# Altium project SIO2MKR.PrjPcb (part 1 of 2)
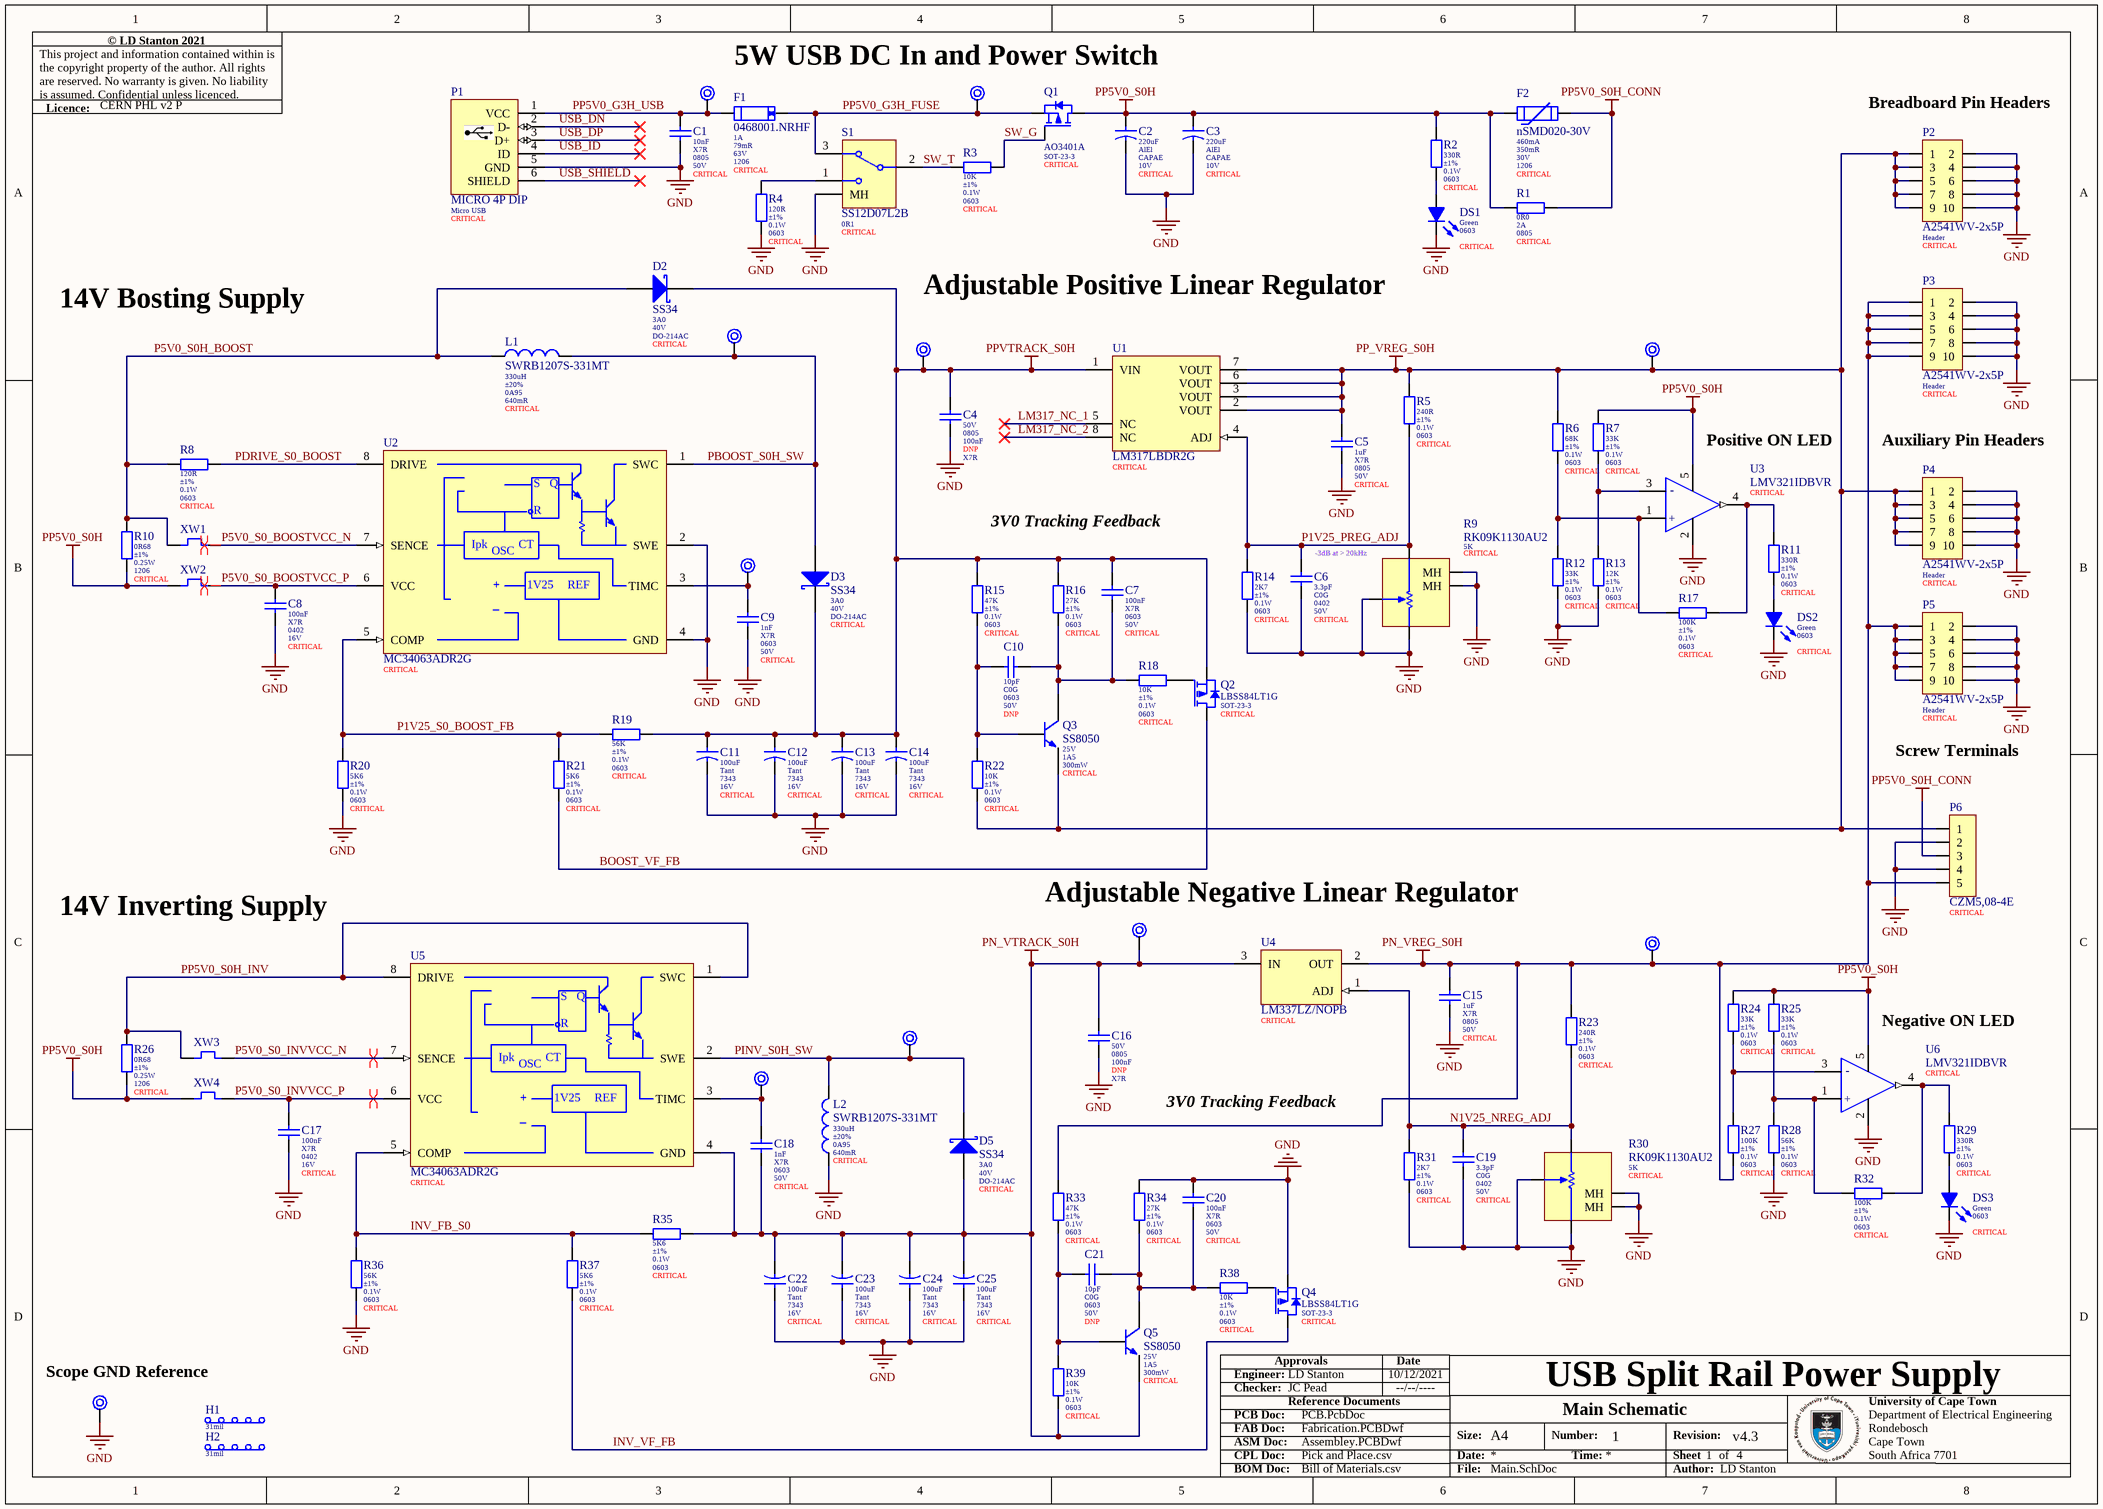
[diagram p0: Main.SchDoc]
SCH_DOC: Main.SchDoc; Rev_No_4: v4.3; Rev_No_3: v3.0; Rev_No_2: v2.0; Rev_No_1: v1.0; Rev_Desc_4: Final Design; Rev_Desc_3: Design Candidate; Rev_Desc_2: Second Prototype; Rev_Desc_1: Initial Prototype; Rev_Date_4: 10/12/2021; Rev_Date_3: 05/08/2021; Rev_Date_2: 07/06/2021; Rev_Date_1: 09/04/2021; Project_Revision: v4.3; Licence: CERN PHL v2 P; DwgTitleLine2: USB Split Rail Power Supply for Breadboards; DwgTitleLine1: SIO2MKR; CPL_DOC: Pick and Place.csv; Checker: JC Pead; BOM_DOC: Bill of Materials.csv; Approv_Date_Eng: 10/12/2021; Approv_Date_Chk: --/--/----
5 sheets, 212 parts. Net scope: global (net labels, ports and power ports of the same name join across sheets).
Board files: PCB.PcbDoc, Panel.PcbDoc
Sheets:
  Main.SchDoc
  Functional Diagram.SchDoc
  Illustrations 1.SchDoc
  Illustrations 2.SchDoc
  Illustrations 3.SchDoc

## Sheet Main.SchDoc: Main Schematic
size A3; SPICEModelCacheWFTKRAJF: <root> / <DocumentId>WFTKRAJF</DocumentId> / <CacheFrame Number="0"> / <Model Name="mc34063" Kind="ckt"> / <Text>.SUBCKT mc34063 csw esw ct comm fb vcc ipk cdr / * csw = switch BJT collector, esw = switch BJT emitter ct = timing capacitor, comm = common / * fb = feedback control, vcc = power in, ipk = peak limiting, cdr = driver BJT collector / * pin numbers match order of inputs above. / * Voltage Sources / Vlogic vp5v comm DC 5V / * Reference and feedback comparator / * The reference is at 1.25V but decreases linearly to zero for Vcc &lt; 3.75V / Breference ref comm V=(V(vcc,comm)-1.25)*u(V(vcc,comm)-1.25)-(V(vcc,comm)-2.5)*u(V(vcc,comm)-3.75) / B1 1 comm V=u(V(ref,fb)) / R6 1 cinvcontrol 10K / C6 cinvcontrol comm 10pF / * Oscillator / * Hysteresis switch to drive current into timing capacitor / R1 vp5v osc 10k / S1 osc comm ct comm swmod / .MODEL swmod SW (SW VT = 1 VH = 0.25) / * Current source to drive charge/discharge currents for the timing capacitor / Bcurrent ct comm I=-35uA+255uA*u(2.5-V(osc,comm)) / * Current limiting circuit increases the charge rate of the timing capacitor / Qlimit ct ipk vcc limitQ / .model limitQ PNP(IS=1E-12 VAF=100 BF=200 IKF=0.1 XTB=1.5 BR=4 / +  CJC=4.5E-12 CJE=10E-12 RB=20 RC=0.1 RE=0.1 TR=250E-9 TF=350E-12 ITF=1 VTF=2 XTF=3) / * Differentiator to provide delays to overcome latch race conditions / Ctrigger osc delay  1pF / Rtrigger delay comm 100K / * Delay pulse squaring comparators plus Delay gating logic. / * inverse of positive delay transition anded with the oscillator to delay the start of / * the next high part. This is then nanded with the feedback gating signal. / Bsetgate set comm V=(1-(1-u(V(delay,comm)-1))*u(V(osc,comm)-2.5)*u(V(cinvcontrol,comm)-0.5)) / * Reset is just the negative delay transition anded with the oscillator and inverted. / Bminus reset comm V=(1-u(V(delay,comm)+1)*(1-u(V(osc,comm)-2.5))) / * SR Latch / Blatch1 4 comm V=(1-V(reset,comm)*u(V(3,comm)-0.5)) / R4 4 2 10K / C4 2 comm 1pF IC=1V / Blatch2 gate comm V=(1-V(set,comm)*u(V(2,comm)-0.5)) / R5 gate 3 10K / C5 3 comm 1pF / * Output switch gating and drive / Bcurrentdrive currentdrive comm I=10mA-20mA*V(gate,comm)*u(V(cinvcontrol,comm)-0.5) / Qdrive cdr currentdrive swbase driverQ / .model driverQ NPN(Bf=300 CJC=4pF CJE=8pF RB=20 RC=0.1 RE=0.1) / D2 comm currentdrive 1N914 / D1 currentdrive vcc 1N914 / .MODEL 1N914 D(Is=2.52n Rs=0.568 N=1.752 Cjo=4p M=.4 Tt=20n) / Rde swbase esw 100 / Qswitch csw swbase esw switchQ / .MODEL switchQ npn (BF=75 RB=10 RE=0.25 RC=0.25 CJE=10pF CJC=10pF) / .ends</Text> / </Model> / </CacheFrame> / </root>; ApprovedBy: LD Stanton; CheckedBy: None; Author: LD Stanton; CompanyName: University of Cape Town; DrawnBy: Lawrence Stanton; Engineer: LD Stanton; Organization: University of Cape Town; Address1: Department of Electrical Engineering; Address2: Rondebosch; Address3: Cape Town; Address4: South Africa 7701; DocumentNumber: 1; Revision: v2.2; SheetNumber: 1; SheetTotal: 4; PCB_Doc: PCB.PcbDoc; ASM_Doc: Assembley.PCBDwf; FAB_Doc: Fabrication.PCBDwf; CML_Doc: Pick and Place.csv; BOM_Doc: Bill of Materials.csv; Project_Name: USB Split Rail Power Supply

### Parts
(Parts that share a designator on the sheet are numbered #1, #2 ... from top to bottom, then left to right.)
C1#1  value 10nF  Dielectric: X7R  Package: 0805  Voltage: 50V  Populate: CRITICAL  [0605_065_A_N]  (hidden comment: CL21B103KBANNNC)
C2#1  value 220uF  Dielectric: AlEl  Package: CAPAE  Voltage: 10V  Populate: CRITICAL  [CAPAE 6354]  (hidden comment: RVT1A221M0605)
C3  value 220uF  Dielectric: AlEl  Package: CAPAE  Voltage: 10V  Populate: CRITICAL  [CAPAE 6354]  (hidden comment: RVT1A221M0605)
C4  value 100nF  Voltage: 50V  Populate: DNP  Dielectric: X7R  [0805]  (hidden comment: CC0805KRX7R9BB104)
C5  value 1uF  Dielectric: X7R  Package: 0805  Voltage: 50V  Populate: CRITICAL  [0805_125_F_N]  (hidden comment: CL21B105KBFNNNE)
C6  value 3.3pF  Dielectric: C0G  Package: 0402  Voltage: 50V  Populate: CRITICAL  [0402_050]  (hidden comment: 0402CG3R3C500NT)
C7  value 100nF  Dielectric: X7R  Voltage: 50V  Populate: CRITICAL  [0603]  (hidden comment: CC0603KRX7R9BB104)
C8  value 100nF  Dielectric: X7R  Package: 0402  Voltage: 16V  Populate: CRITICAL  [0402_050_5_N]  (hidden comment: CL05B104KO5NNNC)
C9  value 1nF  Dielectric: X7R  Package: 0603  Voltage: 50V  Populate: CRITICAL  [0603_080_8_N]  (hidden comment: CL10B102KB8NNNC)
C10  value 10pF  Dielectric: C0G  Package: 0603  Voltage: 50V  Populate: DNP  [0603_080_8_N]  (hidden comment: MLCC 10pF 0603 50V C0G)
C11  value 100uF  Dielectric: Tant  Package: 7343  Voltage: 16V  Populate: CRITICAL  [Case D]  (hidden comment: 293D107X9016D2TE3)
C12  value 100uF  Dielectric: Tant  Package: 7343  Voltage: 16V  Populate: CRITICAL  [Case D]  (hidden comment: 293D107X9016D2TE3)
C13  value 100uF  Dielectric: Tant  Package: 7343  Voltage: 16V  Populate: CRITICAL  [Case D]  (hidden comment: 293D107X9016D2TE3)
C14  value 100uF  Dielectric: Tant  Package: 7343  Voltage: 16V  Populate: CRITICAL  [Case D]  (hidden comment: 293D107X9016D2TE3)
C15  value 1uF  Dielectric: X7R  Package: 0805  Voltage: 50V  Populate: CRITICAL  [0805_125_F_N]  (hidden comment: CL21B105KBFNNNE)
C16  value 100nF  Voltage: 50V  Populate: DNP  Dielectric: X7R  [0805]  (hidden comment: CC0805KRX7R9BB104)
C17  value 100nF  Dielectric: X7R  Package: 0402  Voltage: 16V  Populate: CRITICAL  [0402_050_5_N]  (hidden comment: CL05B104KO5NNNC)
C18  value 1nF  Dielectric: X7R  Package: 0603  Voltage: 50V  Populate: CRITICAL  [0603_080_8_N]  (hidden comment: CL10B102KB8NNNC)
C19  value 3.3pF  Dielectric: C0G  Package: 0402  Voltage: 50V  Populate: CRITICAL  [0402_050]  (hidden comment: 0402CG3R3C500NT)
C20  value 100nF  Dielectric: X7R  Voltage: 50V  Populate: CRITICAL  [0603]  (hidden comment: CC0603KRX7R9BB104)
C21  value 10pF  Dielectric: C0G  Package: 0603  Voltage: 50V  Populate: DNP  [0603_080_8_N]  (hidden comment: MLCC 10pF 0603 50V C0G)
C22  value 100uF  Dielectric: Tant  Package: 7343  Voltage: 16V  Populate: CRITICAL  [Case D]  (hidden comment: 293D107X9016D2TE3)
C23  value 100uF  Dielectric: Tant  Package: 7343  Voltage: 16V  Populate: CRITICAL  [Case D]  (hidden comment: 293D107X9016D2TE3)
C24  value 100uF  Dielectric: Tant  Package: 7343  Voltage: 16V  Populate: CRITICAL  [Case D]  (hidden comment: 293D107X9016D2TE3)
C25  value 100uF  Dielectric: Tant  Package: 7343  Voltage: 16V  Populate: CRITICAL  [Case D]  (hidden comment: 293D107X9016D2TE3)
D2#1  SS34  DC Forward Curent: 3A0  DC Reverse Blocking: 40V  Placement: CRITICAL  [DO-214AC]
D3#1  SS34  DC Forward Curent: 3A0  DC Reverse Blocking: 40V  Placement: CRITICAL  [DO-214AC]
D5#1  SS34  DC Forward Curent: 3A0  DC Reverse Blocking: 40V  Placement: CRITICAL  [DO-214AC]
DS1  Colour: Green  Package: 0603  Placement: CRITICAL  [LED 0603]  (hidden comment: 19-217/GHC-YR1S2/3T)
DS2  Colour: Green  Package: 0603  Placement: CRITICAL  [LED 0603]  (hidden comment: 19-217/GHC-YR1S2/3T)
DS3  Colour: Green  Package: 0603  Placement: CRITICAL  [LED 0603]  (hidden comment: 19-217/GHC-YR1S2/3T)
F1#1  0468001.NRHF  Current: 1A  Resistance: 79mR  Voltage: 63V  Package: 1206  Placement: CRITICAL  [Fuse 1206 (Littlefuse 468) B]
F2#1  nSMD020-30V  Current: 460mA  Resistance: 350mR  Voltage: 30V  Package: 1206  Placement: CRITICAL  [FUSE3216X09N]
H1  Size: 31mil  [Mouse Bites 5 IPC-7351]  (hidden comment: Mouse Bites 5 IPC-7351)  (no BOM)
H2  Size: 31mil  [Mouse Bites 5 IPC-7351]  (hidden comment: Mouse Bites 5 IPC-7351)  (no BOM)
L1#1  SWRB1207S-331MT  value 330uH  Tolerance: ±20%  Rated Current: 0A95  DC Resistance: 640mR  Populate: CRITICAL  [SWRB1207S]
L2#1  SWRB1207S-331MT  value 330uH  Tolerance: ±20%  Rated Current: 0A95  DC Resistance: 640mR  Populate: CRITICAL  [SWRB1207S]
P1  MICRO 4P DIP  USB Connector Type: Micro USB  Placement: CRITICAL  [MICRO 4P DIP]
P2  A2541WV-2x5P  Type: Header  Placement: CRITICAL  [Pin Header 10 2 Vertical Male]
P3  A2541WV-2x5P  Type: Header  Placement: CRITICAL  [Pin Header 10 2 Vertical Male]
P4  A2541WV-2x5P  Type: Header  Placement: CRITICAL  [Pin Header 10 2 Vertical Male]
P5  A2541WV-2x5P  Type: Header  Placement: CRITICAL  [Pin Header 10 2 Vertical Male]
P6  CZM5,08-4E  Placement: CRITICAL  [Screw Down 5]
Q1#1  AO3401A  Package: SOT-23-3  Placement: CRITICAL  [SOT-23-3 (2N7002)]
Q2#1  LBSS84LT1G  Package: SOT-23-3  Placement: CRITICAL  [SOT-23-3 (2N7002)]
Q3  SS8050  VCE: 25V  Collector Current: 1A5  Power: 300mW  Placement: CRITICAL  [SOT-23-3 Generic]
Q4  LBSS84LT1G  Package: SOT-23-3  Placement: CRITICAL  [SOT-23-3 (2N7002)]
Q5  SS8050  VCE: 25V  Collector Current: 1A5  Power: 300mW  Placement: CRITICAL  [SOT-23-3 Generic]
R1#1  value 0R0  Current: 2A  Populate: CRITICAL  [0805]  (hidden comment: 0805W8F0000T5E)
R2#1  value 330R  Tolerance: ±1%  Power: 0.1W  Populate: CRITICAL  [0603]  (hidden comment: 0603WAF3300T5E)
R3#1  value 10K  Tolerance: ±1%  Power: 0.1W  Populate: CRITICAL  [0603]  (hidden comment: 0603WAF1002T5E)
R4#1  value 120R  Tolerance: ±1%  Power: 0.1W  Populate: CRITICAL  [0603]  (hidden comment: 0603WAF1200T5E)
R5#1  value 240R  Tolerance: ±1%  Power: 0.1W  Populate: CRITICAL  [0603]  (hidden comment: 0603WAF2400T5E)
R6  value 68K  Tolerance: ±1%  Power: 0.1W  Populate: CRITICAL  [0603]  (hidden comment: 0603WAF6802T5E)
R7  value 33K  Tolerance: ±1%  Power: 0.1W  Populate: CRITICAL  [0603]  (hidden comment: 0603WAF3302T5E)
R8  value 120R  Tolerance: ±1%  Power: 0.1W  Populate: CRITICAL  [0603]  (hidden comment: 0603WAF1200T5E)
R9  RK09K1130AU2  Resistance: 5K  Placement: CRITICAL  [RK09K113]
R10  value 0R68  Tolerance: ±1%  Power: 0.25W  Populate: CRITICAL  [1206]  (hidden comment: 1206W4F680LT5E)
R11  value 330R  Tolerance: ±1%  Power: 0.1W  Populate: CRITICAL  [0603]  (hidden comment: 0603WAF3300T5E)
R12  value 33K  Tolerance: ±1%  Power: 0.1W  Populate: CRITICAL  [0603]  (hidden comment: 0603WAF3302T5E)
R13  value 12K  Tolerance: ±1%  Power: 0.1W  Populate: CRITICAL  [0603]  (hidden comment: 0603WAF1202T5E)
R14  value 2K7  Tolerance: ±1%  Power: 0.1W  Populate: CRITICAL  [0603]  (hidden comment: 0603WAF2701T5E)
R15  value 47K  Tolerance: ±1%  Power: 0.1W  Package: 0603  Populate: CRITICAL  [0603 (Uniroyal) B]  (hidden comment: 0603WAF4702T5E)
R16  value 27K  Tolerance: ±1%  Power: 0.1W  Populate: CRITICAL  [0603]  (hidden comment: 0603WAF2702T5E)
R17  value 100K  Tolerance: ±1%  Power: 0.1W  Populate: CRITICAL  [0603]  (hidden comment: 0603WAF1003T5E)
R18  value 10K  Tolerance: ±1%  Power: 0.1W  Populate: CRITICAL  [0603]  (hidden comment: 0603WAF1002T5E)
R19  value 56K  Tolerance: ±1%  Power: 0.1W  Populate: CRITICAL  [0603]  (hidden comment: 0603WAF5602T5E)
R20  value 5K6  Tolerance: ±1%  Power: 0.1W  Populate: CRITICAL  [0603]  (hidden comment: 0603WAF5601T5E)
R21  value 5K6  Tolerance: ±1%  Power: 0.1W  Populate: CRITICAL  [0603]  (hidden comment: 0603WAF5601T5E)
R22  value 10K  Tolerance: ±1%  Power: 0.1W  Package: 0603  Populate: CRITICAL  [0603 (Uniroyal) B]  (hidden comment: 0603WAF1002T5E)
R23  value 240R  Tolerance: ±1%  Power: 0.1W  Populate: CRITICAL  [0603]  (hidden comment: 0603WAF2400T5E)
R24  value 33K  Tolerance: ±1%  Power: 0.1W  Populate: CRITICAL  [0603]  (hidden comment: 0603WAF3302T5E)
R25  value 33K  Tolerance: ±1%  Power: 0.1W  Populate: CRITICAL  [0603]  (hidden comment: 0603WAF3302T5E)
R26  value 0R68  Tolerance: ±1%  Power: 0.25W  Populate: CRITICAL  [1206]  (hidden comment: 1206W4F680LT5E)
R27  value 100K  Tolerance: ±1%  Power: 0.1W  Populate: CRITICAL  [0603]  (hidden comment: 0603WAF1003T5E)
R28  value 56K  Tolerance: ±1%  Power: 0.1W  Populate: CRITICAL  [0603]  (hidden comment: 0603WAF5602T5E)
R29  value 330R  Tolerance: ±1%  Power: 0.1W  Populate: CRITICAL  [0603]  (hidden comment: 0603WAF3300T5E)
R30  RK09K1130AU2  Resistance: 5K  Placement: CRITICAL  [RK09K113]
R31  value 2K7  Tolerance: ±1%  Power: 0.1W  Populate: CRITICAL  [0603]  (hidden comment: 0603WAF2701T5E)
R32  value 100K  Tolerance: ±1%  Power: 0.1W  Populate: CRITICAL  [0603]  (hidden comment: 0603WAF1003T5E)
R33  value 47K  Tolerance: ±1%  Power: 0.1W  Package: 0603  Populate: CRITICAL  [0603 (Uniroyal) B]  (hidden comment: 0603WAF4702T5E)
R34  value 27K  Tolerance: ±1%  Power: 0.1W  Populate: CRITICAL  [0603]  (hidden comment: 0603WAF2702T5E)
R35  value 5K6  Tolerance: ±1%  Power: 0.1W  Populate: CRITICAL  [0603]  (hidden comment: 0603WAF5601T5E)
R36  value 56K  Tolerance: ±1%  Power: 0.1W  Populate: CRITICAL  [0603]  (hidden comment: 0603WAF5602T5E)
R37  value 5K6  Tolerance: ±1%  Power: 0.1W  Populate: CRITICAL  [0603]  (hidden comment: 0603WAF5601T5E)
R38  value 10K  Tolerance: ±1%  Power: 0.1W  Populate: CRITICAL  [0603]  (hidden comment: 0603WAF1002T5E)
R39  value 10K  Tolerance: ±1%  Power: 0.1W  Package: 0603  Populate: CRITICAL  [0603 (Uniroyal) B]  (hidden comment: 0603WAF1002T5E)
S1  SS12D07L2B  Resistance: 0R1  Placement: CRITICAL  [SS12D07]
TP1  Test Point  [Test Point 0.6]  (value not drawn)  (no BOM)
TP2  Test Point  [Test Point 0.6]  (value not drawn)  (no BOM)
TP3  Test Point  [Test Point 0.6]  (value not drawn)  (no BOM)
TP4  Test Point  [Test Point 0.6]  (value not drawn)  (no BOM)
TP5  Test Point  [Test Point 0.6]  (value not drawn)  (no BOM)
TP6  Test Point  [Test Point 0.6]  (value not drawn)  (no BOM)
TP7  Test Point  [Test Point 0.6]  (value not drawn)  (no BOM)
TP8  Test Point  [Test Point 0.6]  (value not drawn)  (no BOM)
TP9  Test Point  [Test Point 0.6]  (value not drawn)  (no BOM)
TP10  Test Point  [Test Point 0.6]  (value not drawn)  (no BOM)
TP11  Test Point  [Test Point 0.8 TH]  (value not drawn)  (no BOM)
U1#1  LM317LBDR2G  Placement: CRITICAL  [SOIC-8 NB]
U2#1  MC34063ADR2G  Placement: CRITICAL  [SOIC-8 NB]
U3#1  LMV321IDBVR  Placement: CRITICAL  [FP-DBV0005A-IPC_B]
U4#1  LM337LZ/NOPB  Placement: CRITICAL  [TO-92 (LM337)]
U5#1  MC34063ADR2G  Placement: CRITICAL  [SOIC-8 NB]
U6#1  LMV321IDBVR  Placement: CRITICAL  [FP-DBV0005A-IPC_B]
XW1  Short 2 Nets  [Short 0.5mm 2 Net]  (value not drawn)  (net tie, no BOM)
XW2  Short 2 Nets  [Short 0.5mm 2 Net]  (value not drawn)  (net tie, no BOM)
XW3  Short 2 Nets  [Short 0.5mm 2 Net]  (value not drawn)  (net tie, no BOM)
XW4  Short 2 Nets  [Short 0.5mm 2 Net]  (value not drawn)  (net tie, no BOM)

### Nets
GND: C1#1.2 C2#1.2 C3.2 C4.2 C5.2 C6.2 C8.2 C9.2 C11.2 C12.2 C13.2 C14.2 C15.2 C16.2 C17.2 C19.2 C20.1 C22.1 C23.1 C24.1 C25.1 DS1.K DS2.K DS3.K L2#1.1 P1.5(GND) P2.2 P2.4 P2.6 P2.8 P2.10 P3.2 P3.4 P3.6 P3.8 P3.10 P4.2 P4.4 P4.6 P4.8 P4.10 P5.2 P5.4 P5.6 P5.8 P5.10 P6.2 P6.4 Q4.2(S) R4#1.1 R9.1 R9.2 R9.4(MH) R9.5(MH) R12.2 R13.2 R14.2 R20.1 R28.2 R30.2 R30.3 R30.4(MH) R30.5(MH) R31.2 R34.1 R36.2 S1.EH(MH) TP11.1 U2#1.2(SWE) U2#1.4(GND) U3#1.2(GND) U6#1.2(GND)
PN_VREG_S0H: C15.1 P3.1 P3.3 P3.5 P3.7 P3.9 P5.1 P5.3 P5.5 P5.7 P5.9 P6.5 R23.1 R27.2 R33.1 TP8.1 U4#1.2(OUT)
PN_VTRACK_S0H: C16.1 C18.2 C22.2 C23.2 C24.2 C25.2 D5#1.2(A) Q5.2(E) R35.2 R39.2 TP7.1 U4#1.3(IN) U5#1.4(GND)
PP5V0_S0H: C2#1.1 C3.1 F2#1.1 Q1#1.3(D) R1#1.1 R2#1.1 R7.1 R10.2 R24.1 R25.1 R26.2 U3#1.5(VCC) U6#1.5(VCC) XW2.2 XW4.2
PP5V0_S0H_CONN: F2#1.2 P6.3 R1#1.2
PP_VREG_S0H: C5.1 P2.1 P2.3 P2.5 P2.7 P2.9 P4.1 P4.3 P4.5 P4.7 P4.9 P6.1 Q3.2(E) R5#1.1 R6.1 R22.2 TP5.1 U1#1.2(VOUT) U1#1.3(VOUT) U1#1.6(VOUT) U1#1.7(VOUT)
PPVTRACK_S0H: C4.1 C7.1 C11.1 C12.1 C13.1 C14.1 D2#1.1(K) D3#1.1(K) Q2#1.2(S) R15.1 R16.1 R19.2 TP4.1 U1#1.1(VIN)
BOOST_VF_FB: Q2#1.3(D) R21.2
INV_FB_S0: R35.1 R36.1 R37.2 U5#1.5(COMP)
INV_VF_FB: Q4.3(D) R37.1
LM317_NC_1: U1#1.5(NC)
LM317_NC_2: U1#1.8(NC)
N1V25_NREG_ADJ: C19.1 R23.2 R30.1 R31.1 U4#1.1(ADJ)
P1V25_PREG_ADJ: C6.1 R5#1.2 R9.3 R14.1 U1#1.4(ADJ)
P1V25_S0_BOOST_FB: R19.1 R20.2 R21.1 U2#1.5(COMP)
P5V0_S0_BOOSTVCC_N: U2#1.7(SENCE) XW1.1
P5V0_S0_BOOSTVCC_P: C8.1 U2#1.6(VCC) XW2.1
P5V0_S0_INVVCC_N: U5#1.7(SENCE) XW3.1
P5V0_S0_INVVCC_P: C17.1 U5#1.6(VCC) XW4.1
P5V0_S0H_BOOST: D2#1.2(A) L1#1.1 R8.1 R10.1 XW1.2
PBOOST_S0H_SW: D3#1.2(A) L1#1.2 TP3.1 U2#1.1(SWC)
PDRIVE_S0_BOOST: R8.2 U2#1.8(DRIVE)
PINV_S0H_SW: D5#1.1(K) L2#1.2 TP9.1 U5#1.2(SWE)
PP5V0_G3H_FUSE: F1#1.2 Q1#1.2(S) S1.3 TP2.1
PP5V0_G3H_USB: C1#1.1 F1#1.1 P1.1(VCC) TP1.1
PP5V0_S0H_INV: R26.1 U5#1.1(SWC) U5#1.8(DRIVE) XW3.2
SW_G: Q1#1.1(G) R3#1.2
SW_T: R3#1.1 S1.2
USB_DN: P1.2(D-)
USB_DP: P1.3(D+)
USB_ID: P1.4(ID)
USB_SHIELD: P1.6(SHIELD)
NetC7_2: C7.2 C10.2 Q3.3(C) R16.2 R18.1
NetC9_1: C9.1 TP6.1 U2#1.3(TIMC)
NetC10_1: C10.1 Q3.1(B) R15.2 R22.1
NetC18_1: C18.1 TP10.1 U5#1.3(TIMC)
NetC20_2: C20.2 C21.2 Q5.3(C) R34.2 R38.1
NetC21_1: C21.1 Q5.1(B) R33.2 R39.1
NetDS1_A: DS1.A R2#1.2
NetDS2_A: DS2.A R11.1
NetDS3_A: DS3.A R29.2
NetQ2#1_1: Q2#1.1(G) R18.2
NetQ4_1: Q4.1(G) R38.2
NetR4#1_2: R4#1.2 S1.1
NetR6_2: R6.2 R12.1 R17.1 U3#1.1(1IN+)
NetR7_2: R7.2 R13.1 U3#1.3(1IN-)
NetR11_2: R11.2 R17.2 U3#1.4(OUT)
NetR24_2: R24.2 R27.1 U6#1.3(1IN-)
NetR25_2: R25.2 R28.1 R32.1 U6#1.1(1IN+)
NetR29_1: R29.1 R32.2 U6#1.4(OUT)

### Layout directives
differential pair: P5V0_S0_BOOSTVCC_N, P5V0_S0_BOOSTVCC_P, P5V0_S0_INVVCC_N, P5V0_S0_INVVCC_P

### Notes on the sheet
- 5W USB DC In and Power Switch
- (near P2) Breadboard Pin Headers
- 14V Bosting Supply
- Adjustable Positive Linear Regulator
- (near U3#1) Positive ON LED
- (near P4) Auxiliary Pin Headers
- 3V0 Tracking Feedback
- -3dB at > 20kHz
- Screw Terminals
- 14V Inverting Supply
- (near TP7) Adjustable Negative Linear Regulator
- (near U6#1) Negative ON LED
- (near TP11) Scope GND Reference
- © LD Stanton 2021
- This project and information contained within is the copyright property of the author. All rights are reserved. No warranty is given. No liability is assumed. Confidential unless licenced.
- Licence:
- Engineer:
- Checker:
- Approvals
- Date
- PCB Doc:
- ASM Doc:
- FAB Doc:
- CPL Doc:
- Reference Documents
- Size:
- Date:
- A4
- Number:
- Time:
- Revision:
- Sheet
- of
- BOM Doc:
- File:
- Author:
- (in symbol CMP-000002-5) -; +
- (in symbol MC34063ADR2G) S; Q; R; Ipk; CT; OSC; +; 1V25; REF; _

### Library data of the parts
C1#1 = MLCC 10nF 0805 50V X7R: MLCC 10nF 0805 50V X7R ±10%; Tolerance: ±10%; LCSC Part Number: C1710; ComponentLink1Description: Datasheet; ComponentLink1URL: https://datasheet.lcsc.com/szlcsc/Samsung-Electro-Mechanics-CL05C100JB5NNNC_C32949.pdf; Supplier 1: Digi-Key; Supplier Part Number 1: 1276-1015-1-ND
C2#1 C3 = Cap AlEl 220uF 10V: Aluminium Electrolytic Capacitor 220uF CAPAE 10V ±20%; Manufacturer: Honor Elec; Tolerance: ±20%; LCSC Part Number: C3345; ComponentLink1Description: Datasheet; ComponentLink1URL: https://datasheet.lcsc.com/szlcsc/Samsung-Electro-Mechanics-CL05C100JB5NNNC_C32949.pdf
C4 C16 = MLCC 100nF 50V 0805 X7R: MLCC 100nF 50V 0805 X7R ±10%; Tolerance: ±10%; LCSC Part Number: C49678; ComponentLink1Description: Datasheet; ComponentLink1URL: https://datasheet.lcsc.com/szlcsc/YAGEO-CC0603KRX7R9BB104_C14663.pdf; Package: 0805
C5 C15 = MLCC 1uF 0805 50V X7R: MLCC 1uF 0805 50V X7R ±10%; Tolerance: ±10%; LCSC Part Number: C28323; ComponentLink1Description: Datasheet; ComponentLink1URL: https://datasheet.lcsc.com/szlcsc/Samsung-Electro-Mechanics-CL05C100JB5NNNC_C32949.pdf; Supplier 1: Digi-Key; Supplier 2: Digi-Key; Supplier Part Number 2: 1276-1026-1-ND; Supplier Part Number 1: 1276-1029-1-ND
C6 C19 = MLCC 3.3pF 0402 50V C0G: MLCC 3.3pF 0402 50V C0G ±0.25pF; Tolerance: ±0.25pF; LCSC Part Number: C1565; ComponentLink1Description: Datasheet; ComponentLink1URL: https://datasheet.lcsc.com/szlcsc/Guangdong-Fenghua-Advanced-Tech-0402B102K500NT_C1523.pdf
C7 C20 = MLCC 100nF 50V 0603 X7R: MLCC 100nF 50V 0603 X7R ±10%; Tolerance: ±10%; LCSC Part Number: C14663; ComponentLink1Description: Datasheet; ComponentLink1URL: https://datasheet.lcsc.com/szlcsc/YAGEO-CC0603KRX7R9BB104_C14663.pdf; Supplier 1: Digi-Key; Supplier Part Number 1: 311-1344-6-ND; Package: 0603
C8 C17 = MLCC 100nF 0402 16V X7R: MLCC 100nF 0402 16V X7R ±10%; Tolerance: ±10%; LCSC Part Number: C1525; ComponentLink1Description: Datasheet; ComponentLink1URL: https://datasheet.lcsc.com/szlcsc/Samsung-Electro-Mechanics-CL05C100JB5NNNC_C32949.pdf
C9 C18 = MLCC 1nF 0603 50V X7R: MLCC 1nF 0603 50V X7R ±10%; Tolerance: ±10%; LCSC Part Number: C1588; ComponentLink1Description: Datasheet; ComponentLink1URL: https://datasheet.lcsc.com/szlcsc/Samsung-Electro-Mechanics-CL05C100JB5NNNC_C32949.pdf
C10 C21 = CMP-045-000007-1: MLCC 10pF 0603 C0G ±0.1pF; LCSC Part Number: C1634; Design Item ID: MLCC 10pF 0603 50V C0G; Source: MLCCs Samsung.SchLib; Tolerance: ±0.1pF; ComponentLink1URL: https://datasheet.lcsc.com/szlcsc/Samsung-Electro-Mechanics-CL05C100JB5NNNC_C32949.pdf; ComponentLink1Description: Datasheet
C11-C14 C22-C25 = Cap Tant 100uF 16V Vishay: Tantalum Capacitor 100uF 16V ±20%; Manufacturer: Vishay; Tolerance: ±20%; LCSC Part Number: C129696; ComponentLink1Description: Datasheet; ComponentLink1URL: https://datasheet.lcsc.com/szlcsc/Vishay-Intertech-293D107X9016D2TE3_C129696.pdf
D2#1 D3#1 D5#1 = SS34: Schottky Barrier Diode 40V 3A0 550mV; Manufacturer: MDD; LCSC Part Number: C8678; ComponentLink1Description: Datasheet; ComponentLink1URL: https://datasheet.lcsc.com/szlcsc/1903051003_MDD-Jiangsu-Yutai-Elec-SS34_C8678.pdf; Package: DO-214AC
DS1-DS3 = CMP-035-000000-4: LED 0603 SMT Green; Forward Voltage: 3V3; Dominant Wavelength: 528nm; Forward Current: 20mA; ComponentLink1Description: Datasheet; LCSC Part Number: C72043; Pin Count: 2; ComponentLink1URL: https://datasheet.lcsc.com/szlcsc/Everlight-Elec-19-217-GHC-YR1S2-3T_C72043.pdf
F1#1 = CMP-005-00003-1: Fuse 1A 63VAC/VDC SMD Littlefuse; Body Material: Thin Film; RoHS Compliant: Yes; Max Operating Temperature: 90°C; Min Operating Temperature: -55°C; LCSC Part Number: C45157; ComponentLink1Description: Datasheet; ComponentLink1URL: https://datasheet.lcsc.com/lcsc/1810111814_Littelfuse-0468001.NRHF_C45157.pdf
F2#1 = CMP-065-000000-4: Fuse SMD PTC Resettable 460mA 30VDC 1206; Source: Fuses.SchLib; LCSC Part Number: C69680; Type: PTC Resettable; Design Item ID: Fuse 460mA PTC 1206; ComponentLink1Description: Datasheet; ComponentLink1URL: https://datasheet.lcsc.com/lcsc/1811141110_TECHFUSE-nSMD020-30V_C69680.pdf
H1 H2 = CMP-00028-00006-1: Mouse Bites 5 Hile Specified by IPC-7351
L1#1 L2#1 = Inductor 330uH ±20% 0A95: Inductor 330uH ±20% 0A95 640mR Moulded SMD 12.5x12.5x8.0mm; Manufacturer: Sunlord; ComponentLink1Description: Datasheet; ComponentLink1URL: https://datasheet.lcsc.com/szlcsc/1912111437_Sunlord-MWSA0603S-220MT_C408453.pdf; Saturation Current: 0A95; LCSC Part Number: C169381
P1 = MICRO 4P DIP: Micro USB Connector SMT with TH Mounts; LCSC Part Number: C456008
P2-P5 = Pin Header 10 2 Male Vertical: Pin Header 10 Way Double Row Vertical Angle; ComponentLink1Description: Datasheet; ComponentLink1URL: https://datasheet.lcsc.com/szlcsc/2010160505_CJT-Changjiang-Connectors-A2541WV-2x5P_C225520.pdf; LCSC Part Number: C225520
P6 = Screw Down 5 Way 5.08mm: Screw Down Terminal 5 Way 5.08mm Pitch
Q1#1 = AO3401A: MOSFET Trench 4A0 30V 85mR ±12V P-Channel Enhancement AOS SOT-22-3L; VGS(th) Max: -1v3; Power: 0.9W; Id Max: 3A2; VDS Max: -30V; ComponentLink2URL: https://datasheet.lcsc.com/szlcsc/Alpha-Omega-Semicon-AOS-AO3401A_C15127.pdf; VGS Max: ±12V; ComponentLink2Description: Datasheet; Rds Max: 85mR; LCSC Part Number: C15127
Q2#1 Q4 = LBSS84LT1G: Small Signal MOSFET, 130 mA, 50 V, P-Channel, Enhancement, LRC SOT-23-3; Ciss Typ: 30pF; VGS(th) Max: 2V0; Crss Typ: 5pF; VGS Max: ±20V; Power: 0.225W; Coss Typ: 10pF; Id Max: 0.13A; Rds Max: 10R; VDS Max: -50V; ComponentLink2URL: https://datasheet.lcsc.com/szlcsc/Leshan-Radio-LBSS84LT1G_C8492.pdf; ComponentLink2Description: Datasheet; LCSC Part Number: C8492
Q3 Q5 = SS8050: BJT NPN 1A5 25V SOT-23-3; Manufacturer: Changjiang Electronics; DC Gain: 120-400; VCE(sat): 0V5; LCSC Part Number: C2150; ComponentLink1Description: Datasheet; ComponentLink1URL: https://datasheet.lcsc.com/szlcsc/Changjiang-Electronics-Tech-CJ-SS8050_C2150.pdf
R1#1 = CMP-010-000281-11: Jumper 0805 2A Uniroyal; Tolerance: ±1%; Package: 0805; ComponentLink1Description: Datasheet; LCSC Part Number: C17477; Manufacturer: Uniroyal; ComponentLink1URL: https://datasheet.lcsc.com/szlcsc/1811062009_UNI-ROYAL-Uniroyal-Elec-0603WAF1002T5E_C25804.pdf; Temperature: -55 - 155°C; Pin Count: 2
R2#1 R11 R29 = Res 330R 0603: Lead Free Thick Film Chip Resistor 0805 ±1%; ComponentLink1Description: Datasheet; ComponentLink1URL: https://datasheet.lcsc.com/szlcsc/1811062009_UNI-ROYAL-Uniroyal-Elec-0603WAF1002T5E_C25804.pdf; Temperature: -55 ~ 155°C; LCSC Part Number: C23138; Package: 0603
R3#1 R38 = Res 10K 0603: Lead Free Thick Film Chip Resistor 0603 ±1%; ComponentLink1Description: Datasheet; ComponentLink1URL: https://datasheet.lcsc.com/szlcsc/1811062009_UNI-ROYAL-Uniroyal-Elec-0603WAF1002T5E_C25804.pdf; Temperature: -55 ~ 155°C; LCSC Part Number: C25804; Package: 0603
R4#1 R8 = Res 120R 0603: Lead Free Thick Film Chip Resistor 0603 ±1%; ComponentLink1Description: Datasheet; ComponentLink1URL: https://datasheet.lcsc.com/szlcsc/1811062009_UNI-ROYAL-Uniroyal-Elec-0603WAF1002T5E_C25804.pdf; Temperature: -55 ~ 155°C; LCSC Part Number: C22787; Package: 0603
R5#1 R23 = Res 240R 0603: Lead Free Thick Film Chip Resistor 0603 ±1%; ComponentLink1Description: Datasheet; ComponentLink1URL: https://datasheet.lcsc.com/szlcsc/1811062009_UNI-ROYAL-Uniroyal-Elec-0603WAF1002T5E_C25804.pdf; Temperature: -55 ~ 155°C; LCSC Part Number: C23350; Package: 0603
R6 = CMP-010-000350-7: Resistor 68K 0603 ±1% Thick Film Uniroyal; Working Voltage: 50V; Temperature Coefficient: ±100ppm/K; Package: 0603; ComponentLink1Description: Datasheet; Temperature: -55 - 155°C; ComponentLink1URL: https://datasheet.lcsc.com/szlcsc/1811062009_UNI-ROYAL-Uniroyal-Elec-0603WAF1002T5E_C25804.pdf; LCSC Part Number: C23231; Pin Count: 2; Manufacturer: Uniroyal
R7 R12 R24 R25 = CMP-010-000332-8: Resistor 33K 0603 ±1% Thick Film Uniroyal; Working Voltage: 50V; Temperature Coefficient: ±100ppm/K; Package: 0603; Temperature: -55 - 155°C; LCSC Part Number: C4216; ComponentLink1URL: https://datasheet.lcsc.com/szlcsc/1811062009_UNI-ROYAL-Uniroyal-Elec-0603WAF1002T5E_C25804.pdf; Pin Count: 2; ComponentLink1Description: Datasheet; Manufacturer: Uniroyal
R9 R30 = Pot 5K THT 9.8mm: 5K Potentiometer THT 9.8mm Diameter ±20% 20VDC; Manufacturer: Alpsalpine; LCSC Part Number: C388855
R10 R26 = Res 0R68 1206: Lead Free Thick Film Chip Resistor 1206 ±1%; ComponentLink1Description: Datasheet; ComponentLink1URL: https://datasheet.lcsc.com/szlcsc/1811062009_UNI-ROYAL-Uniroyal-Elec-0603WAF1002T5E_C25804.pdf; Temperature: -55 ~ 155°C; LCSC Part Number: C19108; Package: 1206
R13 = CMP-010-000351-9: Resistor 12K 0603 ±1% Thick Film Uniroyal; Working Voltage: 50V; Temperature Coefficient: ±100ppm/K; Package: 0603; ComponentLink1URL: https://datasheet.lcsc.com/szlcsc/1811062009_UNI-ROYAL-Uniroyal-Elec-0603WAF1002T5E_C25804.pdf; Temperature: -55 - 155°C; Pin Count: 2; LCSC Part Number: C22790; ComponentLink1Description: Datasheet; Manufacturer: Uniroyal
R14 R31 = Res 2K7 0603: Lead Free Thick Film Chip Resistor 0603 ±1%; ComponentLink1Description: Datasheet; ComponentLink1URL: https://datasheet.lcsc.com/szlcsc/1811062009_UNI-ROYAL-Uniroyal-Elec-0603WAF1002T5E_C25804.pdf; Temperature: -55 ~ 155°C; LCSC Part Number: C13167; Package: 0603
R15 R33 = CMP-010-000404-1: Resistor 47K 0603 ±1% Thick Film Uniroyal; Working Voltage: 50V; Temperature Coefficient: ±100ppm/K; ComponentLink1Description: Datasheet; LCSC Part Number: C25819; Temperature: -55 - 155°C; ComponentLink1URL: https://datasheet.lcsc.com/szlcsc/1811062009_UNI-ROYAL-Uniroyal-Elec-0603WAF1002T5E_C25804.pdf; Manufacturer: Uniroyal; Pin Count: 2
R16 R34 = Res 27K 0603: Lead Free Thick Film Chip Resistor 0603 ±1%; ComponentLink1Description: Datasheet; ComponentLink1URL: https://datasheet.lcsc.com/szlcsc/1811062009_UNI-ROYAL-Uniroyal-Elec-0603WAF1002T5E_C25804.pdf; Temperature: -55 ~ 155°C; LCSC Part Number: C22967; Package: 0603
R17 R27 R32 = CMP-010-000288-8: Resistor 100K 0603 ±1% Thick Film Uniroyal; Working Voltage: 50V; Temperature Coefficient: ±100ppm/K; Package: 0603; ComponentLink1URL: https://datasheet.lcsc.com/szlcsc/1811062009_UNI-ROYAL-Uniroyal-Elec-0603WAF1002T5E_C25804.pdf; Temperature: -55 - 155°C; ComponentLink1Description: Datasheet; Pin Count: 2; LCSC Part Number: C25803; Manufacturer: Uniroyal
R18 = CMP-010-000293-7: Resistor 10K 0603 ±1% Thick Film Uniroyal; Working Voltage: 50V; Temperature Coefficient: ±100ppm/K; Package: 0603; ComponentLink1Description: Datasheet; Pin Count: 2; Temperature: -55 - 155°C; ComponentLink1URL: https://datasheet.lcsc.com/szlcsc/1811062009_UNI-ROYAL-Uniroyal-Elec-0603WAF1002T5E_C25804.pdf; LCSC Part Number: C25804; Manufacturer: Uniroyal
R19 R36 = Res 56K 0603: Lead Free Thick Film Chip Resistor 0603 ±1%; ComponentLink1Description: Datasheet; ComponentLink1URL: https://datasheet.lcsc.com/szlcsc/1811062009_UNI-ROYAL-Uniroyal-Elec-0603WAF1002T5E_C25804.pdf; Temperature: -55 ~ 155°C; LCSC Part Number: C23206; Package: 0603
R20 R21 R35 R37 = Res 5K6 0603: Lead Free Thick Film Chip Resistor 0603 ±1%; ComponentLink1Description: Datasheet; ComponentLink1URL: https://datasheet.lcsc.com/szlcsc/1811062009_UNI-ROYAL-Uniroyal-Elec-0603WAF1002T5E_C25804.pdf; Temperature: -55 ~ 155°C; LCSC Part Number: C23189; Package: 0603
R22 R39 = CMP-010-000293-8: Resistor 10K 0603 ±1% Thick Film Uniroyal; Temperature Coefficient: ±100ppm/K; Working Voltage: 50V; Manufacturer: Uniroyal; LCSC Part Number: C25804; ComponentLink1URL: https://datasheet.lcsc.com/szlcsc/1811062009_UNI-ROYAL-Uniroyal-Elec-0603WAF1002T5E_C25804.pdf; Pin Count: 2; Temperature: -55 - 155°C; ComponentLink1Description: Datasheet
R28 = CMP-010-000340-8: Resistor 56K 0603 ±1% Thick Film Uniroyal; Working Voltage: 50V; Temperature Coefficient: ±100ppm/K; Package: 0603; Pin Count: 2; Temperature: -55 - 155°C; ComponentLink1Description: Datasheet; ComponentLink1URL: https://datasheet.lcsc.com/szlcsc/1811062009_UNI-ROYAL-Uniroyal-Elec-0603WAF1002T5E_C25804.pdf; LCSC Part Number: C23206; Manufacturer: Uniroyal
S1 = SS12D07L2B: Switch Toggle Slider THT Vertical 0A3 50V; LCSC Part Number: C480342; Voltage: 50V; Current: 0A3
TP1-TP11 = Test Point: Test Point. Multiple pad options.
U1#1 = LM317LDR2G: 100mA, 1V2 - 37V Adjustable Output, Positive Voltage Regulator; Manufacturer: ON Semiconductor; LCSC Part Number: C7940; ComponentLink1Description: Datasheet; ComponentLink1URL: https://datasheet.lcsc.com/szlcsc/ON-Semicon-ON-LM317LBDR2G_C274645.pdf; Supplier 1: Bison Technologies; Supplier Part Number 1: LM317LBDR2G-158539-ON SEMICONDUCTOR
U2#1 U5#1 = MC34063ADR2G: 1A5 Step-Up, Step-Down, Inverting Switching Reulator; Manufacturer: ON Semi; LCSC Part Number: C32078; Supplier 1: Digi-Key; Supplier Part Number 1: MC34063ADR2GOSCT-ND; ComponentLink1Description: Datasheet; ComponentLink1URL: https://www.onsemi.com/pdf/datasheet/mc34063a-d.pdf; ComponentLink2Description: Application Note; ComponentLink2URL: https://www.onsemi.com/pub/Collateral/AN920-D.PDF
U3#1 U6#1 = CMP-000002-5: OP AMP, 1MHZ, 1V/uS, SOT-23-5, FULL REEL; Bandwidth:1MHz; No. of Amplifiers:1; Slew Rate:1V/ s; Supply Voltage Range:2.7V to 5.5V; Amplifier Case Style:SOT-23; No. of Pins:5; Operating Temperature Min:-40 C; Packaging:Tape & Reel ;RoHS Compliant: Yes; LCSC Part Number: C7972; ComponentLink1URL: https://www.ti.com/lit/ds/symlink/lmv321.pdf?ts=1625124174430&ref_url=https%253A%252F%252Fwww.ti.com%252Fproduct%252FLMV321%253Futm_source%253Dgoogle%2526utm_medium%253Dcpc%2526utm_campaign%253Dasc-null-null-GPN_EN-cpc-pf-google-eu%2526utm_content%253DLMV321%2526ds_k%253DLMV321%2526DCM%253Dyes%2526gclid%253DCjwKCAjwz_WGBhA1EiwAUAxIcXFhr0oBZP9h7i0ZlpGDWrUqXkjNKF1mzIZ0pwkBWJ5DKtwNyNkjjRoCiuIQAvD_BwE%2526gclsrc%253Daw.ds; ComponentLink1Description: Datasheet
U4#1 = CMP-008-000015-2: 100mA, -1V2 to -37V Adjustable Negative Voltage Regulator; Manufacturer: Texas Instruments; Current Rating: 1A; ComponentLink1URL: https://www.ti.com/lit/ds/symlink/lm337l.pdf?ts=1616125755321&ref_url=https%253A%252F%252Fwww.google.ru%252F; Max Operating Temperature: 100°C; ComponentLink1Description: Datasheet; LCSC Part Number: C33082; Min Operating Temperature: -25°C; Output Current: 100mA; RoHS Compliant: Yes
XW1-XW4 = Short 2 Nets: Net Tie 2 Nets; Value: 0

## Sheet Functional Diagram.SchDoc: Functional Diagram
size A4; ApprovedBy: LD Stanton; Author: LD Stanton; CompanyName: University of Cape Town; DrawnBy: Lawrence Stanton; Engineer: Lawrence Stanton; Organization: University of Cape Town; Address1: Department of Electrical Engineering; Address2: Rondebosch; Address3: Cape Town; Address4: South Africa 7701; DocumentNumber: 2; SheetNumber: 2; SheetTotal: 4
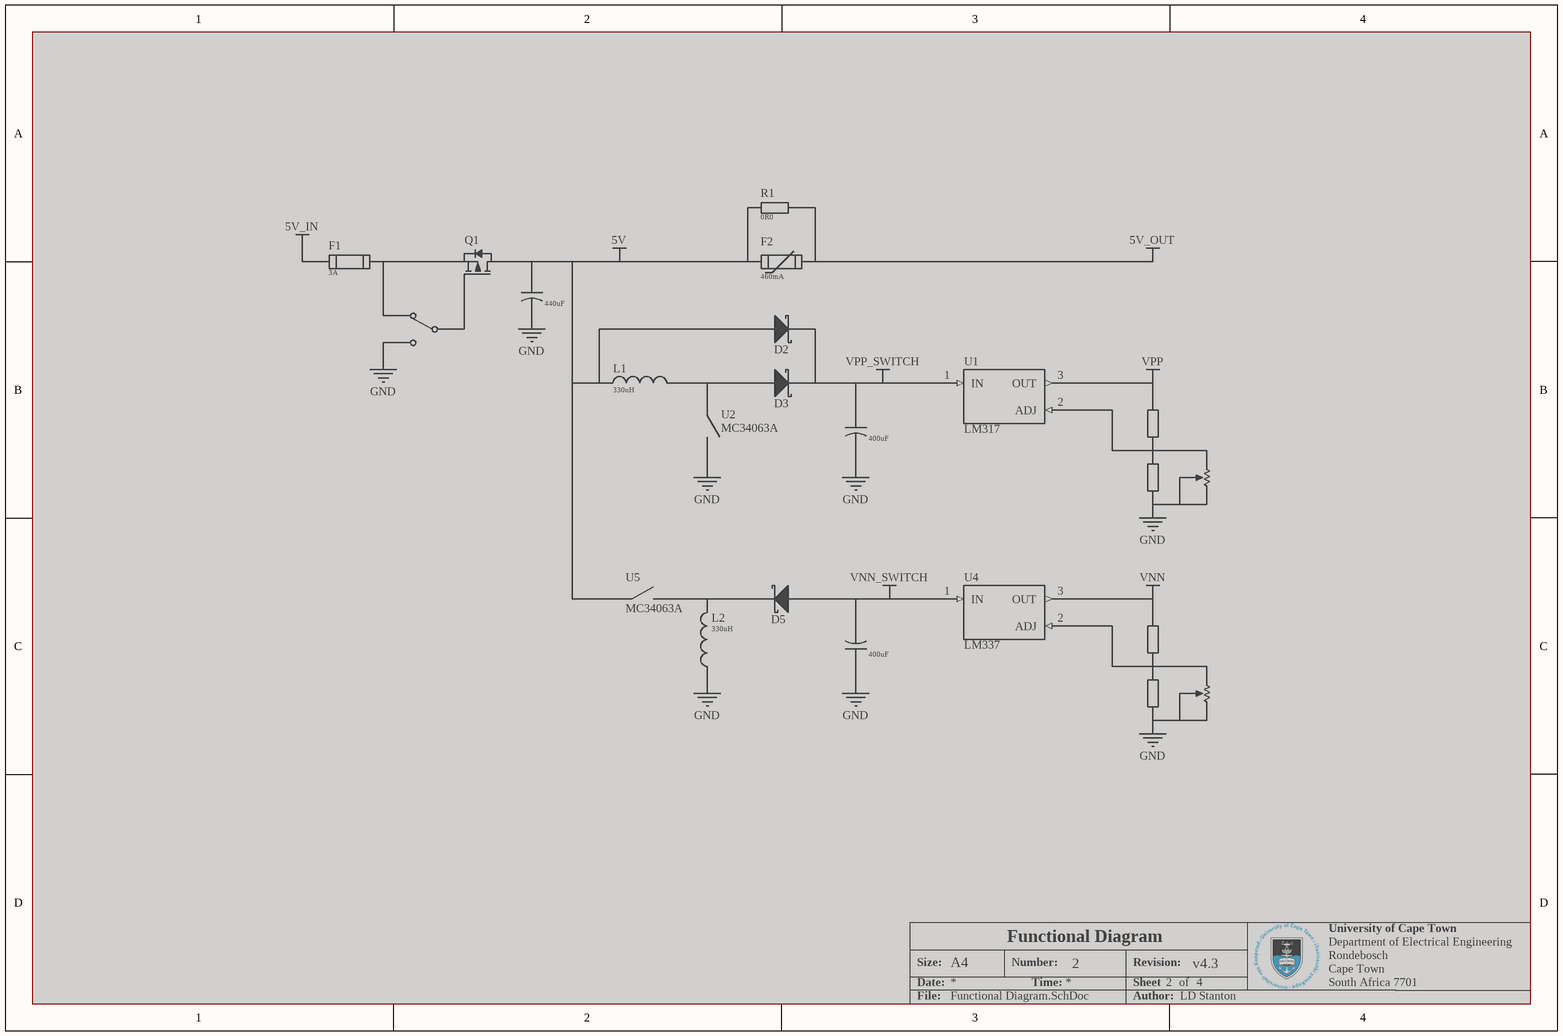
[diagram p1: Functional Diagram.SchDoc]

### Parts
(Parts that share a designator on the sheet are numbered #1, #2 ... from top to bottom, then left to right.)
C?#1  value 440uF  (hidden comment: Capacitor Polarised Illustration)  (graphical)  (masked out: inside a compile mask, not in the netlist)
C?#2  value 400uF  (hidden comment: Capacitor Polarised Illustration)  (graphical)  (masked out: inside a compile mask, not in the netlist)
C?#3  value 400uF  (hidden comment: Capacitor Polarised Illustration)  (graphical)  (masked out: inside a compile mask, not in the netlist)
D2#2  Schottky Diode Illustration  (value not drawn)  (graphical)  (masked out: inside a compile mask, not in the netlist)
D3#2  Schottky Diode Illustration  (value not drawn)  (graphical)  (masked out: inside a compile mask, not in the netlist)
D5#2  Schottky Diode Illustration  (value not drawn)  (graphical)  (masked out: inside a compile mask, not in the netlist)
F1#2  Current: 3A  (hidden comment: Fuse Illustration IEC)  (graphical)  (masked out: inside a compile mask, not in the netlist)
F2#2  Current: 460mA  (hidden comment: Fuse PTC Illustration IEC)  (graphical)  (masked out: inside a compile mask, not in the netlist)
L1#2  value 330uH  (hidden comment: Inductor Illustration)  (graphical)  (masked out: inside a compile mask, not in the netlist)
L2#2  value 330uH  (hidden comment: Inductor Illustration)  (graphical)  (masked out: inside a compile mask, not in the netlist)
Q1#2  MOSFET P-Channel Illustration  (value not drawn)  (graphical)  (masked out: inside a compile mask, not in the netlist)
R1#2  value 0R0  (hidden comment: Resistor Box Illustration)  (graphical)  (masked out: inside a compile mask, not in the netlist)
R?#1  Resistor Box Illustration  (value not drawn)  (graphical)  (masked out: inside a compile mask, not in the netlist)
R?#2  Resistor Box Illustration  (value not drawn)  (graphical)  (masked out: inside a compile mask, not in the netlist)
R?#3  Potentiometer Illustration  (value not drawn)  (graphical)  (masked out: inside a compile mask, not in the netlist)
R?#4  Resistor Box Illustration  (value not drawn)  (graphical)  (masked out: inside a compile mask, not in the netlist)
R?#5  Resistor Box Illustration  (value not drawn)  (graphical)  (masked out: inside a compile mask, not in the netlist)
R?#6  Potentiometer Illustration  (value not drawn)  (graphical)  (masked out: inside a compile mask, not in the netlist)
SW?  Switch Double Throw Toggling Illustration  (value not drawn)  (graphical)  (masked out: inside a compile mask, not in the netlist)
U1#2  LM317  (graphical)  (masked out: inside a compile mask, not in the netlist)
U2#2  MC34063A  (graphical)  (masked out: inside a compile mask, not in the netlist)
U4#2  LM337  (graphical)  (masked out: inside a compile mask, not in the netlist)
U5#2  MC34063A  (graphical)  (masked out: inside a compile mask, not in the netlist)

### Notes on the sheet
- Size:
- Date:
- A4
- Number:
- Time:
- Revision:
- Sheet
- of
- File:
- Author:

### Library data of the parts
C?#1-C?#3 = CMP-000004-7: Polarised Capacitor for Illustration; Placement: CRITICAL; Tolerance: ±0%; Voltage: 0V; Temperature Coefficient: ±0ppm/K; Package: 0000; Temperature: -0 - 0°C
D2#2 D3#2 D5#2 = CMP-00003-4: Schottky Diode for Ilustration; Blocking Voltage: 0V0; Forward Current: 0A0; Placement: CRITICAL; Temperature: -0 - 0°C; Forward Voltage: 0V0
F1#2 = CMP-000005-8: IEC Style Fuse for Illustration; Placement: CRITICAL; Resistance: 0K0; Voltage: 0V; Package: 0000; Temperature: -0 - 0°C
F2#2 = CMP-000006-7: IEC Style PTC Fuse for Illustration; Placement: CRITICAL; Resistance: 0K0; Voltage: 0V; Package: 0000; Temperature: -0 - 0°C
L1#2 L2#2 = CMP-000009-4: General Inductor for Illustration; Rated Current: 0A; Tolerance: ±0%; Temperature Coefficient: ±0ppm/K; Placement: CRITICAL; Resistance: 0K0; Temperature: -0 - 0°C; Saturation Current: 0A
Q1#2 = CMP-00001-3: P-Channel MOSFET 3-Terminal for Illustration; Drain-Source Voltage: 0V; Current: 0A; Placement: CRITICAL; Temperature: -0 - 0°C; Gate Threshold Voltage: 0V; Gate-Source Voltage: 0V
R1#2 = CMP-010-000360-14: Resistor for Illustration. Box Symbol.; Working Voltage: 0V; Power: 0W; Placement: CRITICAL; Tolerance: ±0%; Temperature Coefficient: ±0ppm/K; Package: 0000; Temperature: -0 - 0°C
R?#1 R?#2 R?#4 R?#5 = CMP-010-000360-14: Resistor for Illustration. Box Symbol.; Value: 0K0; Working Voltage: 0V; Power: 0W; Placement: CRITICAL; Tolerance: ±0%; Temperature Coefficient: ±0ppm/K; Package: 0000; Temperature: -0 - 0°C
R?#3 R?#6 = CMP-010-000362-3: Potentiometer for Illustration.; Value: 0K0; Working Voltage: 0V; Placement: CRITICAL; Power: 0W; Temperature Coefficient: ±0ppm/K; Tolerance: ±0%; Temperature: -0 - 0°C
SW? = CMP-00006-1: Double Throw Toggling Switch for Illustration; Current: 0A; Placement: CRITICAL; Voltage: 0V; Temperature: -0 - 0°C
U1#2 U4#2 = CMP-000013-1: Adjustible Linear Regulator for Illustration
U2#2 U5#2 = CMP-000007-9: Single Throw General Switch for Illustration; Placement: CRITICAL; Current: 0A; Voltage: 0V; Temperature: -0 - 0°C

## Sheet Illustrations 1.SchDoc: Illustrations 1
size A4; ApprovedBy: LD Stanton; Author: LD Stanton; CompanyName: University of Cape Town; DrawnBy: Lawrence Stanton; Engineer: Lawrence Stanton; Organization: University of Cape Town; Address1: Department of Electrical Engineering; Address2: Rondebosch; Address3: Cape Town; Address4: South Africa 7701; DocumentNumber: 3; SheetNumber: 3; SheetTotal: 4
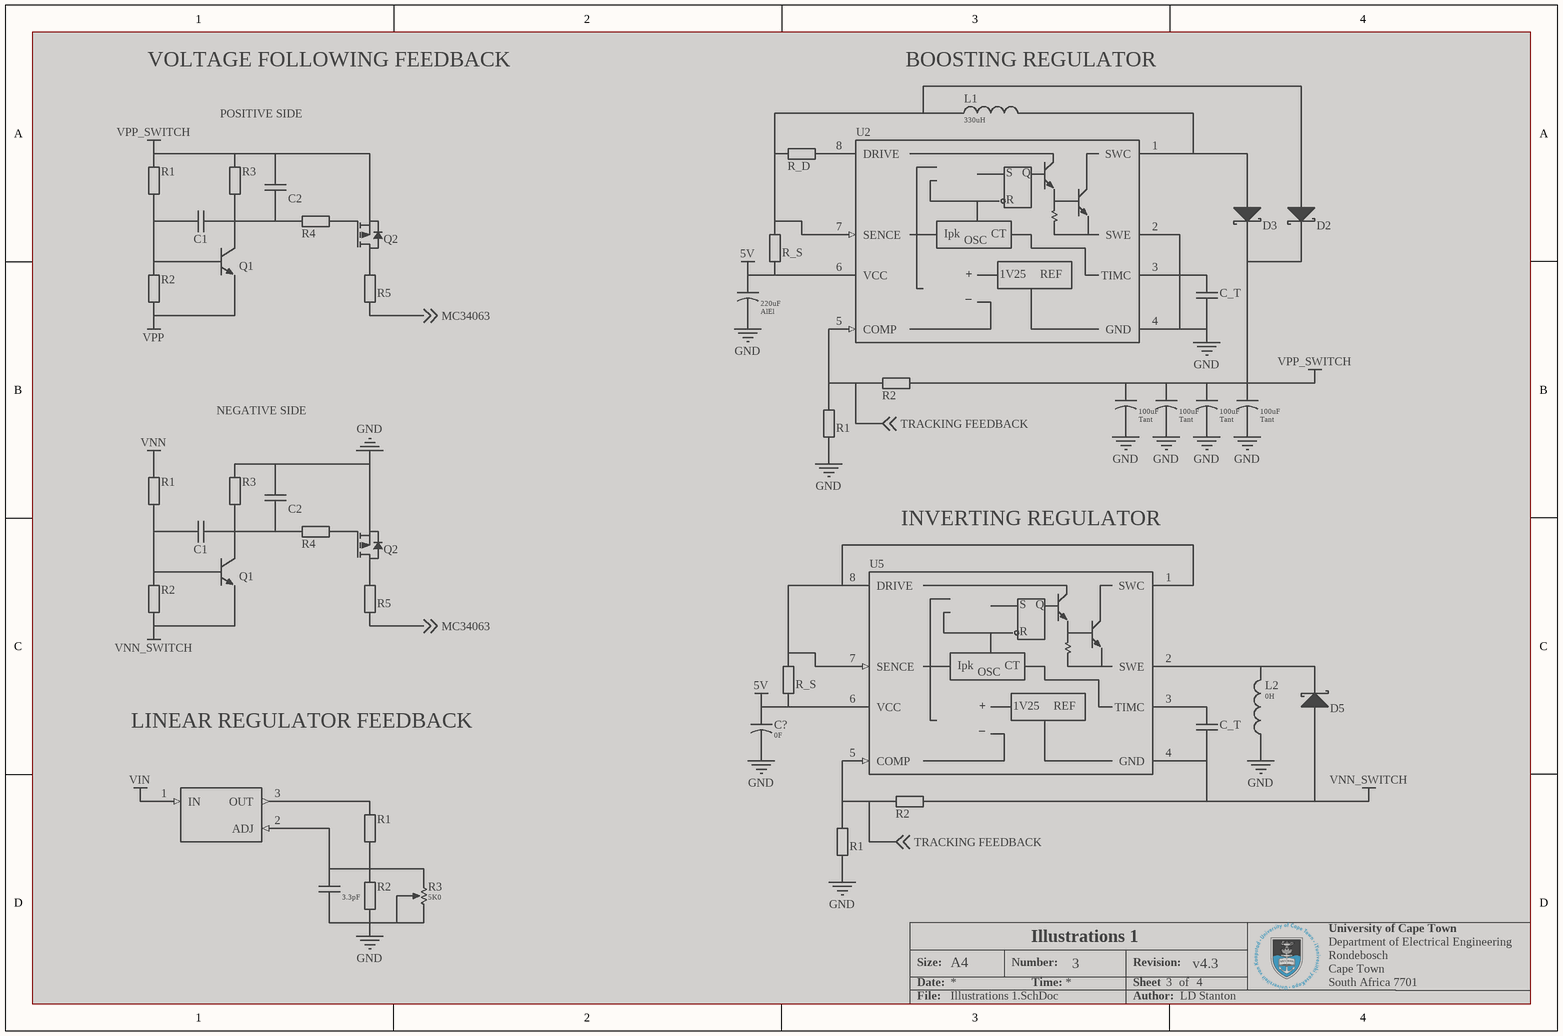
[diagram p2: Illustrations 1.SchDoc]

### Parts
(Parts that share a designator on the sheet are numbered #1, #2 ... from top to bottom, then left to right.)
C1#2  Capacitor Non-Polarised Illustration  (value not drawn)  (graphical)  (masked out: inside a compile mask, not in the netlist)
C1#3  Capacitor Non-Polarised Illustration  (value not drawn)  (graphical)  (masked out: inside a compile mask, not in the netlist)
C2#2  Capacitor Non-Polarised Illustration  (value not drawn)  (graphical)  (masked out: inside a compile mask, not in the netlist)
C2#3  Capacitor Non-Polarised Illustration  (value not drawn)  (graphical)  (masked out: inside a compile mask, not in the netlist)
C?#4  value 220uF  Dielectric: AlEl  (hidden comment: Capacitor Polarised Illustration)  (graphical)  (masked out: inside a compile mask, not in the netlist)
C?#5  value 100uF  Dielectric: Tant  (hidden comment: Capacitor Polarised Illustration)  (graphical)  (masked out: inside a compile mask, not in the netlist)
C?#6  value 100uF  Dielectric: Tant  (hidden comment: Capacitor Polarised Illustration)  (graphical)  (masked out: inside a compile mask, not in the netlist)
C?#7  value 100uF  Dielectric: Tant  (hidden comment: Capacitor Polarised Illustration)  (graphical)  (masked out: inside a compile mask, not in the netlist)
C?#8  value 100uF  Dielectric: Tant  (hidden comment: Capacitor Polarised Illustration)  (graphical)  (masked out: inside a compile mask, not in the netlist)
C?#9  value 0F  (hidden comment: Capacitor Polarised Illustration)  (graphical)  (masked out: inside a compile mask, not in the netlist)
C?#10  value 3.3pF  (hidden comment: Capacitor Non-Polarised Illustration)  (graphical)  (masked out: inside a compile mask, not in the netlist)
C_T#1  Capacitor Non-Polarised Illustration  (value not drawn)  (graphical)  (masked out: inside a compile mask, not in the netlist)
C_T#2  Capacitor Non-Polarised Illustration  (value not drawn)  (graphical)  (masked out: inside a compile mask, not in the netlist)
D2#3  Schottky Diode Illustration  (value not drawn)  (graphical)  (masked out: inside a compile mask, not in the netlist)
D3#3  Schottky Diode Illustration  (value not drawn)  (graphical)  (masked out: inside a compile mask, not in the netlist)
D5#3  Schottky Diode Illustration  (value not drawn)  (graphical)  (masked out: inside a compile mask, not in the netlist)
L1#3  value 330uH  (hidden comment: Inductor Illustration)  (graphical)  (masked out: inside a compile mask, not in the netlist)
L2#3  value 0H  (hidden comment: Inductor Illustration)  (graphical)  (masked out: inside a compile mask, not in the netlist)
Q1#3  BJT NPN Illustration  (value not drawn)  (graphical)  (masked out: inside a compile mask, not in the netlist)
Q1#4  BJT NPN Illustration  (value not drawn)  (graphical)  (masked out: inside a compile mask, not in the netlist)
Q2#2  MOSFET P-Channel Illustration  (value not drawn)  (graphical)  (masked out: inside a compile mask, not in the netlist)
Q2#3  MOSFET P-Channel Illustration  (value not drawn)  (graphical)  (masked out: inside a compile mask, not in the netlist)
R1#3  Resistor Box Illustration  (value not drawn)  (graphical)  (masked out: inside a compile mask, not in the netlist)
R1#4  Resistor Box Illustration  (value not drawn)  (graphical)  (masked out: inside a compile mask, not in the netlist)
R1#5  Resistor Box Illustration  (value not drawn)  (graphical)  (masked out: inside a compile mask, not in the netlist)
R1#6  Resistor Box Illustration  (value not drawn)  (graphical)  (masked out: inside a compile mask, not in the netlist)
R1#7  Resistor Box Illustration  (value not drawn)  (graphical)  (masked out: inside a compile mask, not in the netlist)
R2#2  Resistor Box Illustration  (value not drawn)  (graphical)  (masked out: inside a compile mask, not in the netlist)
R2#3  Resistor Box Illustration  (value not drawn)  (graphical)  (masked out: inside a compile mask, not in the netlist)
R2#4  Resistor Box Illustration  (value not drawn)  (graphical)  (masked out: inside a compile mask, not in the netlist)
R2#5  Resistor Box Illustration  (value not drawn)  (graphical)  (masked out: inside a compile mask, not in the netlist)
R2#6  Resistor Box Illustration  (value not drawn)  (graphical)  (masked out: inside a compile mask, not in the netlist)
R3#2  Resistor Box Illustration  (value not drawn)  (graphical)  (masked out: inside a compile mask, not in the netlist)
R3#3  Resistor Box Illustration  (value not drawn)  (graphical)  (masked out: inside a compile mask, not in the netlist)
R3#4  value 5K0  (hidden comment: Potentiometer Illustration)  (graphical)  (masked out: inside a compile mask, not in the netlist)
R4#2  Resistor Box Illustration  (value not drawn)  (graphical)  (masked out: inside a compile mask, not in the netlist)
R4#3  Resistor Box Illustration  (value not drawn)  (graphical)  (masked out: inside a compile mask, not in the netlist)
R5#2  Resistor Box Illustration  (value not drawn)  (graphical)  (masked out: inside a compile mask, not in the netlist)
R5#3  Resistor Box Illustration  (value not drawn)  (graphical)  (masked out: inside a compile mask, not in the netlist)
R_D#1  Resistor Box Illustration  (value not drawn)  (graphical)  (masked out: inside a compile mask, not in the netlist)
R_S#1  Resistor Box Illustration  (value not drawn)  (graphical)  (masked out: inside a compile mask, not in the netlist)
R_S#2  Resistor Box Illustration  (value not drawn)  (graphical)  (masked out: inside a compile mask, not in the netlist)
U2#3  MC34063 Illustration  (value not drawn)  (graphical)  (masked out: inside a compile mask, not in the netlist)
U5#3  MC34063 Illustration  (value not drawn)  (graphical)  (masked out: inside a compile mask, not in the netlist)
U?  Linear Regulator Adjustible Illustration  (value not drawn)  (graphical)  (masked out: inside a compile mask, not in the netlist)

### Notes on the sheet
- POSITIVE SIDE
- VOLTAGE FOLLOWING FEEDBACK
- (near L1#3) BOOSTING REGULATOR
- NEGATIVE SIDE
- INVERTING REGULATOR
- LINEAR REGULATOR FEEDBACK
- Size:
- Date:
- A4
- Number:
- Time:
- Revision:
- Sheet
- of
- File:
- Author:
- (in symbol CMP-000014-1) S; Q; R; Ipk; CT; OSC; +; 1V25; REF; _

### Library data of the parts
C1#2 C1#3 C2#2 C2#3 C_T#1 C_T#2 = CMP-000003-10: Non-Polarised Capacitor for Illustration.; Value: 0F; Tolerance: ±0%; Temperature Coefficient: ±0ppm/K; Placement: CRITICAL; Voltage: 0V; Package: 0000; Temperature: -0 - 0°C
C?#4-C?#8 = CMP-000004-8: Polarised Capacitor for Illustration; Temperature Coefficient: ±0ppm/K; Tolerance: ±0%; Voltage: 0V; Placement: CRITICAL; Temperature: -0 - 0°C; Package: 0000
C?#9 = CMP-000004-7: as C?#1 on sheet Functional Diagram; Package: 0000; Temperature: -0 - 0°C
C?#10 = CMP-000003-10: Non-Polarised Capacitor for Illustration.; Tolerance: ±0%; Temperature Coefficient: ±0ppm/K; Placement: CRITICAL; Voltage: 0V; Package: 0000; Temperature: -0 - 0°C
D2#3 D3#3 D5#3 = CMP-00003-4: as D2#2 on sheet Functional Diagram; Temperature: -0 - 0°C; Forward Voltage: 0V0
L1#3 L2#3 = CMP-000009-4: as L1#2 on sheet Functional Diagram; Temperature: -0 - 0°C; Saturation Current: 0A
Q1#3 Q1#4 = CMP-000010-2: NPN Bipolar Junction Transistor for Illustration; Collector Current: 0A; Power: 0W; Collector-Emitter Voltage: 0V; Placement: CRITICAL; Saturation Voltgae: 0V; Temperature: -0 - 0°C
Q2#2 Q2#3 = CMP-00001-3: as Q1#2 on sheet Functional Diagram; Gate-Source Voltage: 0V; Gate Threshold Voltage: 0V; Temperature: -0 - 0°C
R1#3-R1#7 R2#2-R2#6 R3#2 R3#3 R4#2 R4#3 R5#2 R5#3 R_D#1 R_S#1 R_S#2 = CMP-010-000360-14: as R?#1 on sheet Functional Diagram; Package: 0000; Temperature: -0 - 0°C
R3#4 = CMP-010-000362-3: Potentiometer for Illustration.; Working Voltage: 0V; Placement: CRITICAL; Power: 0W; Temperature Coefficient: ±0ppm/K; Tolerance: ±0%; Temperature: -0 - 0°C
U2#3 U5#3 = CMP-000014-1: MC34063A for Illustration; Placement: CRITICAL
U? = CMP-000013-1: as U1#2 on sheet Functional Diagram